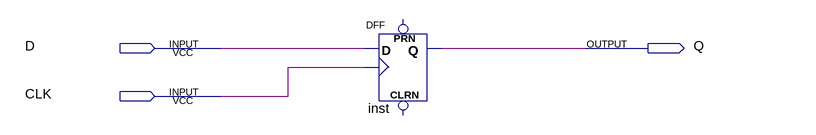
[diagram p0: schematic sheet]
// Quartus schematic Delay_flip_flop.bdf as structural Verilog: 1 symbols, 3 pins
module Delay_flip_flop (
  input  D,
  input  CLK,
  output Q
);

  DFF inst (.CLK(CLK), .D(D), .Q(Q));  // open: CLRN, PRN
endmodule
